# EAGLE schematic Koala_Bear (EAGLE 6.5.0)
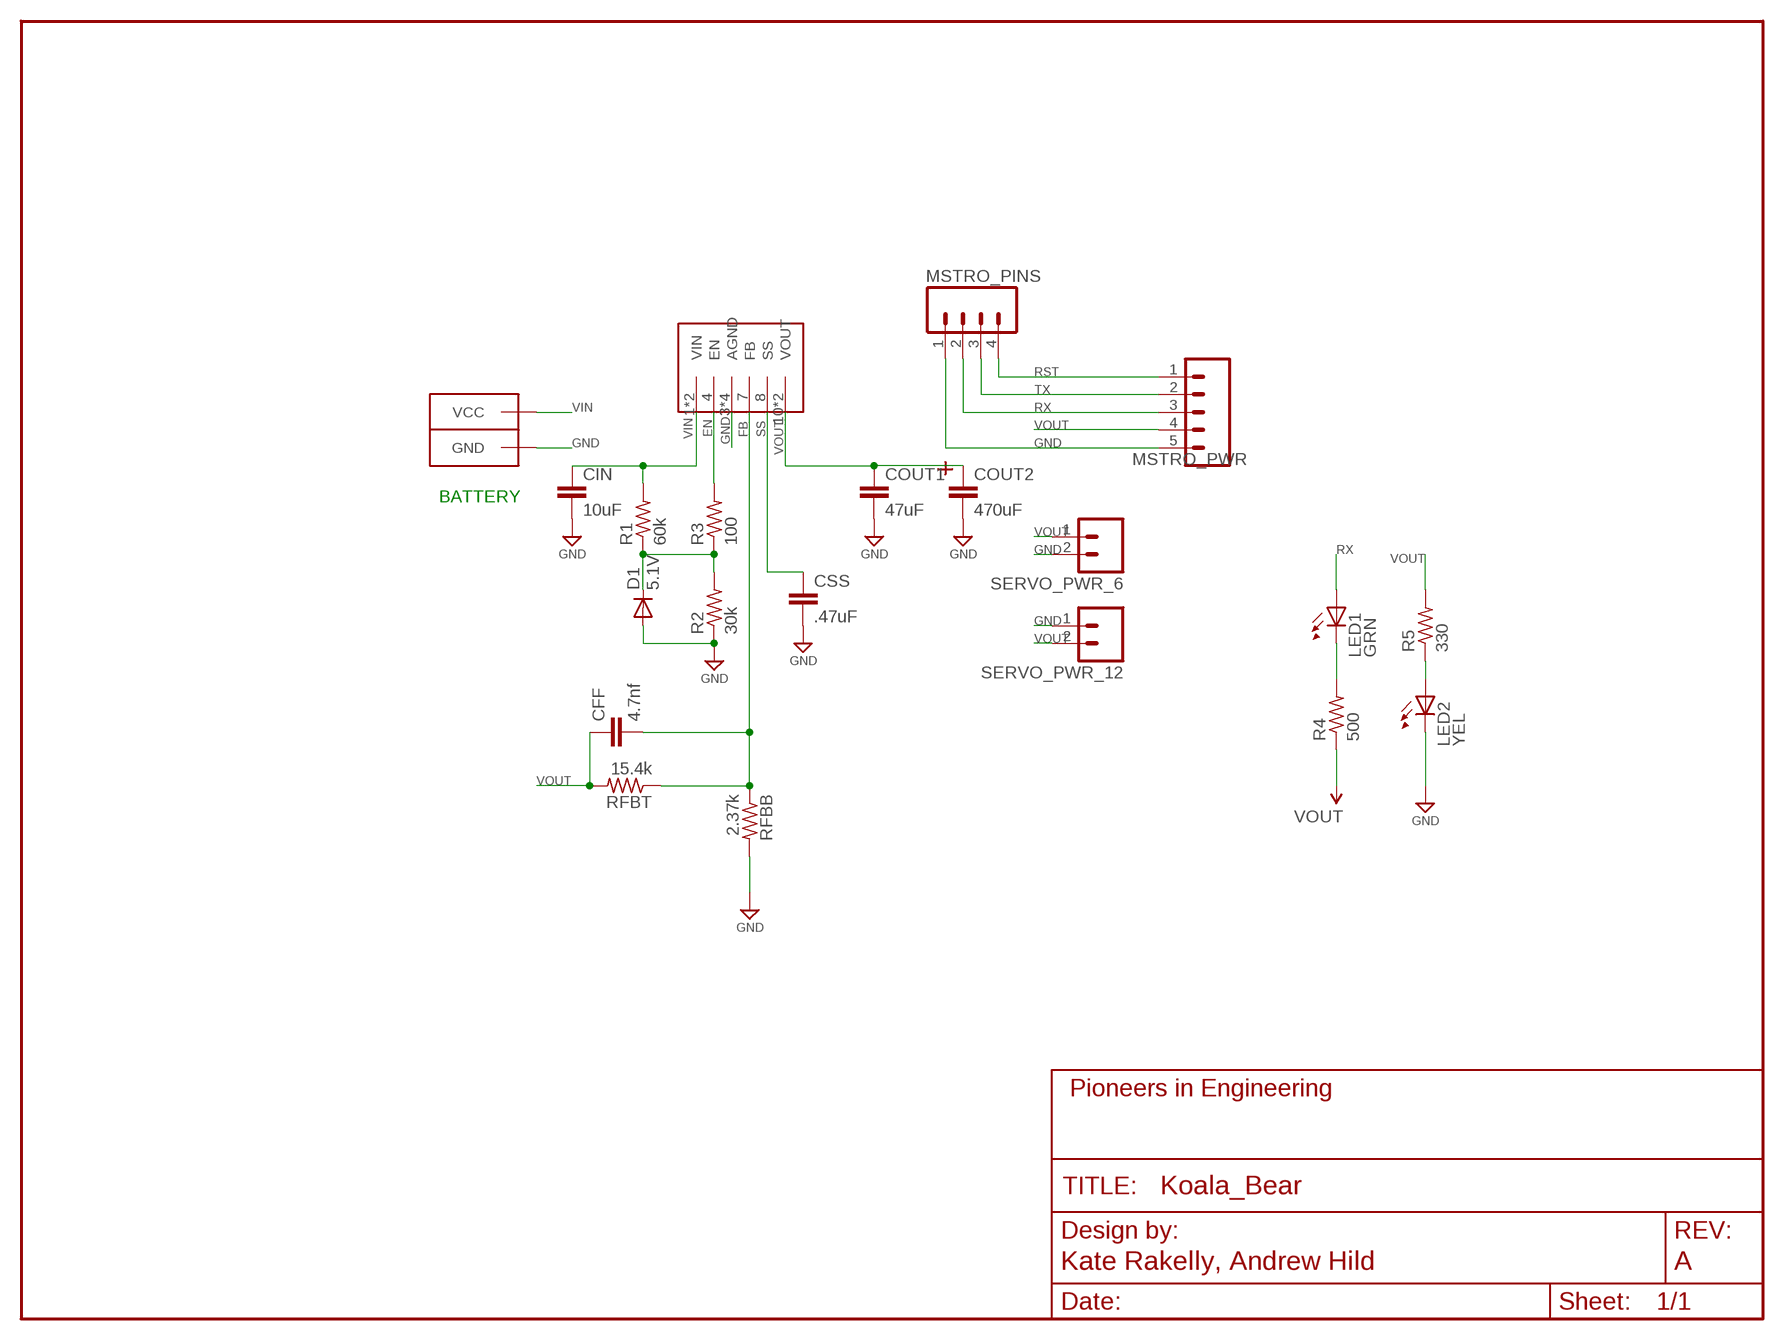
[diagram p0: schematic, sheet 1]
FRAME1 (FRAME-LETTER): AUTHOR: Kate Rakelly, Andrew Hild; REVISION: A

## Parts
CFF  4.7nf  CAP0603-CAP  [0603-CAP]
CIN  10uF  CAP0603-CAP  [0603-CAP]
COUT1  47uF  CAP1206  [1206]
COUT2  470uF  TANT_CASE_E  [TANT_CASE_E]
CSS  .47uF  CAP0603-CAP  [0603-CAP]
D1  5.1V  DIODESOD  [SOD-323]
LED1  GRN  LED0805  [LED-0805]
LED2  YEL  LED0805  [LED-0805]
MSTRO_PINS  M041X04-MTA  [1X04-MTA]
MSTRO_PWR  M05MTA  [1X05-MTA]
PWR  ANDERSONVERTICAL  [ANDERSON_VERTICAL]
R1  60k  R-US_R0603  [R0603]
R2  30k  R-US_R0603  [R0603]
R3  100  R-US_R0603  [R0603]
R4  500  R-US_R0603  [R0603]
R5  330  R-US_R0603  [R0603]
RFBB  2.37k  R-US_R0603  [R0603]
RFBT  15.4k  R-US_R0603  [R0603]
SERVO_PWR_6  M02PTH  [1X02]
SERVO_PWR_12  M02PTH  [1X02]
U$1  LMZ12010  [LMZ12010]

## Nets
DIODE: D1.1(C) R1.1 R2.2 R3.1
EN: R3.2 U$1.4(EN)
FB: CFF.2 RFBB.1 RFBT.1 U$1.7(FB)
GND: CIN.2 COUT1.2 COUT2.NEG CSS.2 D1.2(A) LED2.C MSTRO_PINS.1 MSTRO_PWR.5 PWR.PIN1(GND) R2.1 RFBB.2 SERVO_PWR_6.2 SERVO_PWR_12.1 U$1.3(AGND) U$1.5(AGND) U$1.6(AGND) U$1.GND(AGND)
N$1: LED1.C R4.2
N$5: LED2.A R5.1
RST: MSTRO_PINS.4 MSTRO_PWR.1
RX: LED1.A MSTRO_PINS.2 MSTRO_PWR.3
SS: CSS.1 U$1.8(SS)
TX: MSTRO_PINS.3 MSTRO_PWR.2
VIN: CIN.1 PWR.PIN2(VCC) R1.2 U$1.1(VIN) U$1.2(VIN)
VOUT: CFF.1 COUT1.1 COUT2.POS MSTRO_PWR.4 R4.1 R5.2 RFBT.2 SERVO_PWR_6.1 SERVO_PWR_12.2 U$1.10(VOUT) U$1.11(VOUT)

## Notes on the sheet
- BATTERY

## Library data of the parts
CFF CIN CSS = pie:CAP: Capacitor Standard 0603 ceramic capacitor, and 0.1" leaded capacitor.
COUT1 = SparkFun:CAP: Capacitor Standard 0603 ceramic capacitor, and 0.1" leaded capacitor.
COUT2 = TANT_CASE_E:TANT_CASE_E
D1 = SparkFun:DIODE: Diode These are standard reverse protection diodes and small signal diodes. SMA package can handle up to about 1A. SOD-323 can handle about 200mA. What the SOD-323 package when ordering, there are some mfgs out there that are 5-pin packages.
LED1 LED2 = pie:LED: LEDs Standard schematic elements and footprints for 5mm, 3mm, 1206, and 0603 sized LEDs. 5mm - Spark Fun Electronics SKU : COM-00529 (and others)
MSTRO_PINS = pie_new:M04: Header 4 Standard 4-pin 0.1" header. Use with straight break away headers (SKU : PRT-00116), right angle break away headers (PRT-00553), swiss pins (PRT-00743), machine pins (PRT-00117), and female headers (PRT-00115). Molex polarized connector foot print use with SKU : PRT-08231 with associated crimp pins and housings. 1MM SMD Version SKU: PRT-10208; PARTNUMBER: A1922-ND
MSTRO_PWR = pie:M05: 5-pin 0.1-inch header and MTA connector; PARTNUMBER: A19471-ND
PWR = pie:ANDERSON: 2-pin 25A Anderson Connector http://www.alliedelec.com/images/products/datasheets/bm/ANDERSON_POWER_PRODUCTS/70162018.pdf; PARTNUMBER: 1377G3
R1-R5 RFBB RFBT = pie:R-US_: RESISTOR, American symbol
SERVO_PWR_6 SERVO_PWR_12 = pie:M02: 2-pin 0.1-inch header and MTA connector
U$1 = LMZ12010:LMZ12010